# Altium schematic sheet 1_wiring drawing.SchDoc: CAN HUB
size A2; ApprovedBy: Approved By; CheckedBy: Sky; DrawnBy: Jack; Address1: 1; Address2: 2; Address3: 3; Address4: 4; DocumentNumber: 04-TE-42-4015-0PA-A; Revision: B; SheetNumber: 2; SheetTotal: 6; SheetSize: A2; CheckedByDate: 2022-11-19; DrawByDate: 2022-11-17; SiteName: EMS TD Huangpu; PageSetup: Record=PageOptions|CenterHorizontal=True|CenterVertical=True|PrintScale=0.73|XCorrection=1.00|YCorrection=1.00|PrintKind=0|BorderSize=5000000|LeftOffset=0|BottomOffset=0|Orientation=2|PaperLength=1000|PaperWidth=1000|Scale=100|PaperSource=15|PrintQuality=1200|MediaType=1|DitherType=10|PaperKind=A3|PrintScaleMode=1; ProjectName: 19205_BMW CCU DDR PCBA FT fixture wiring
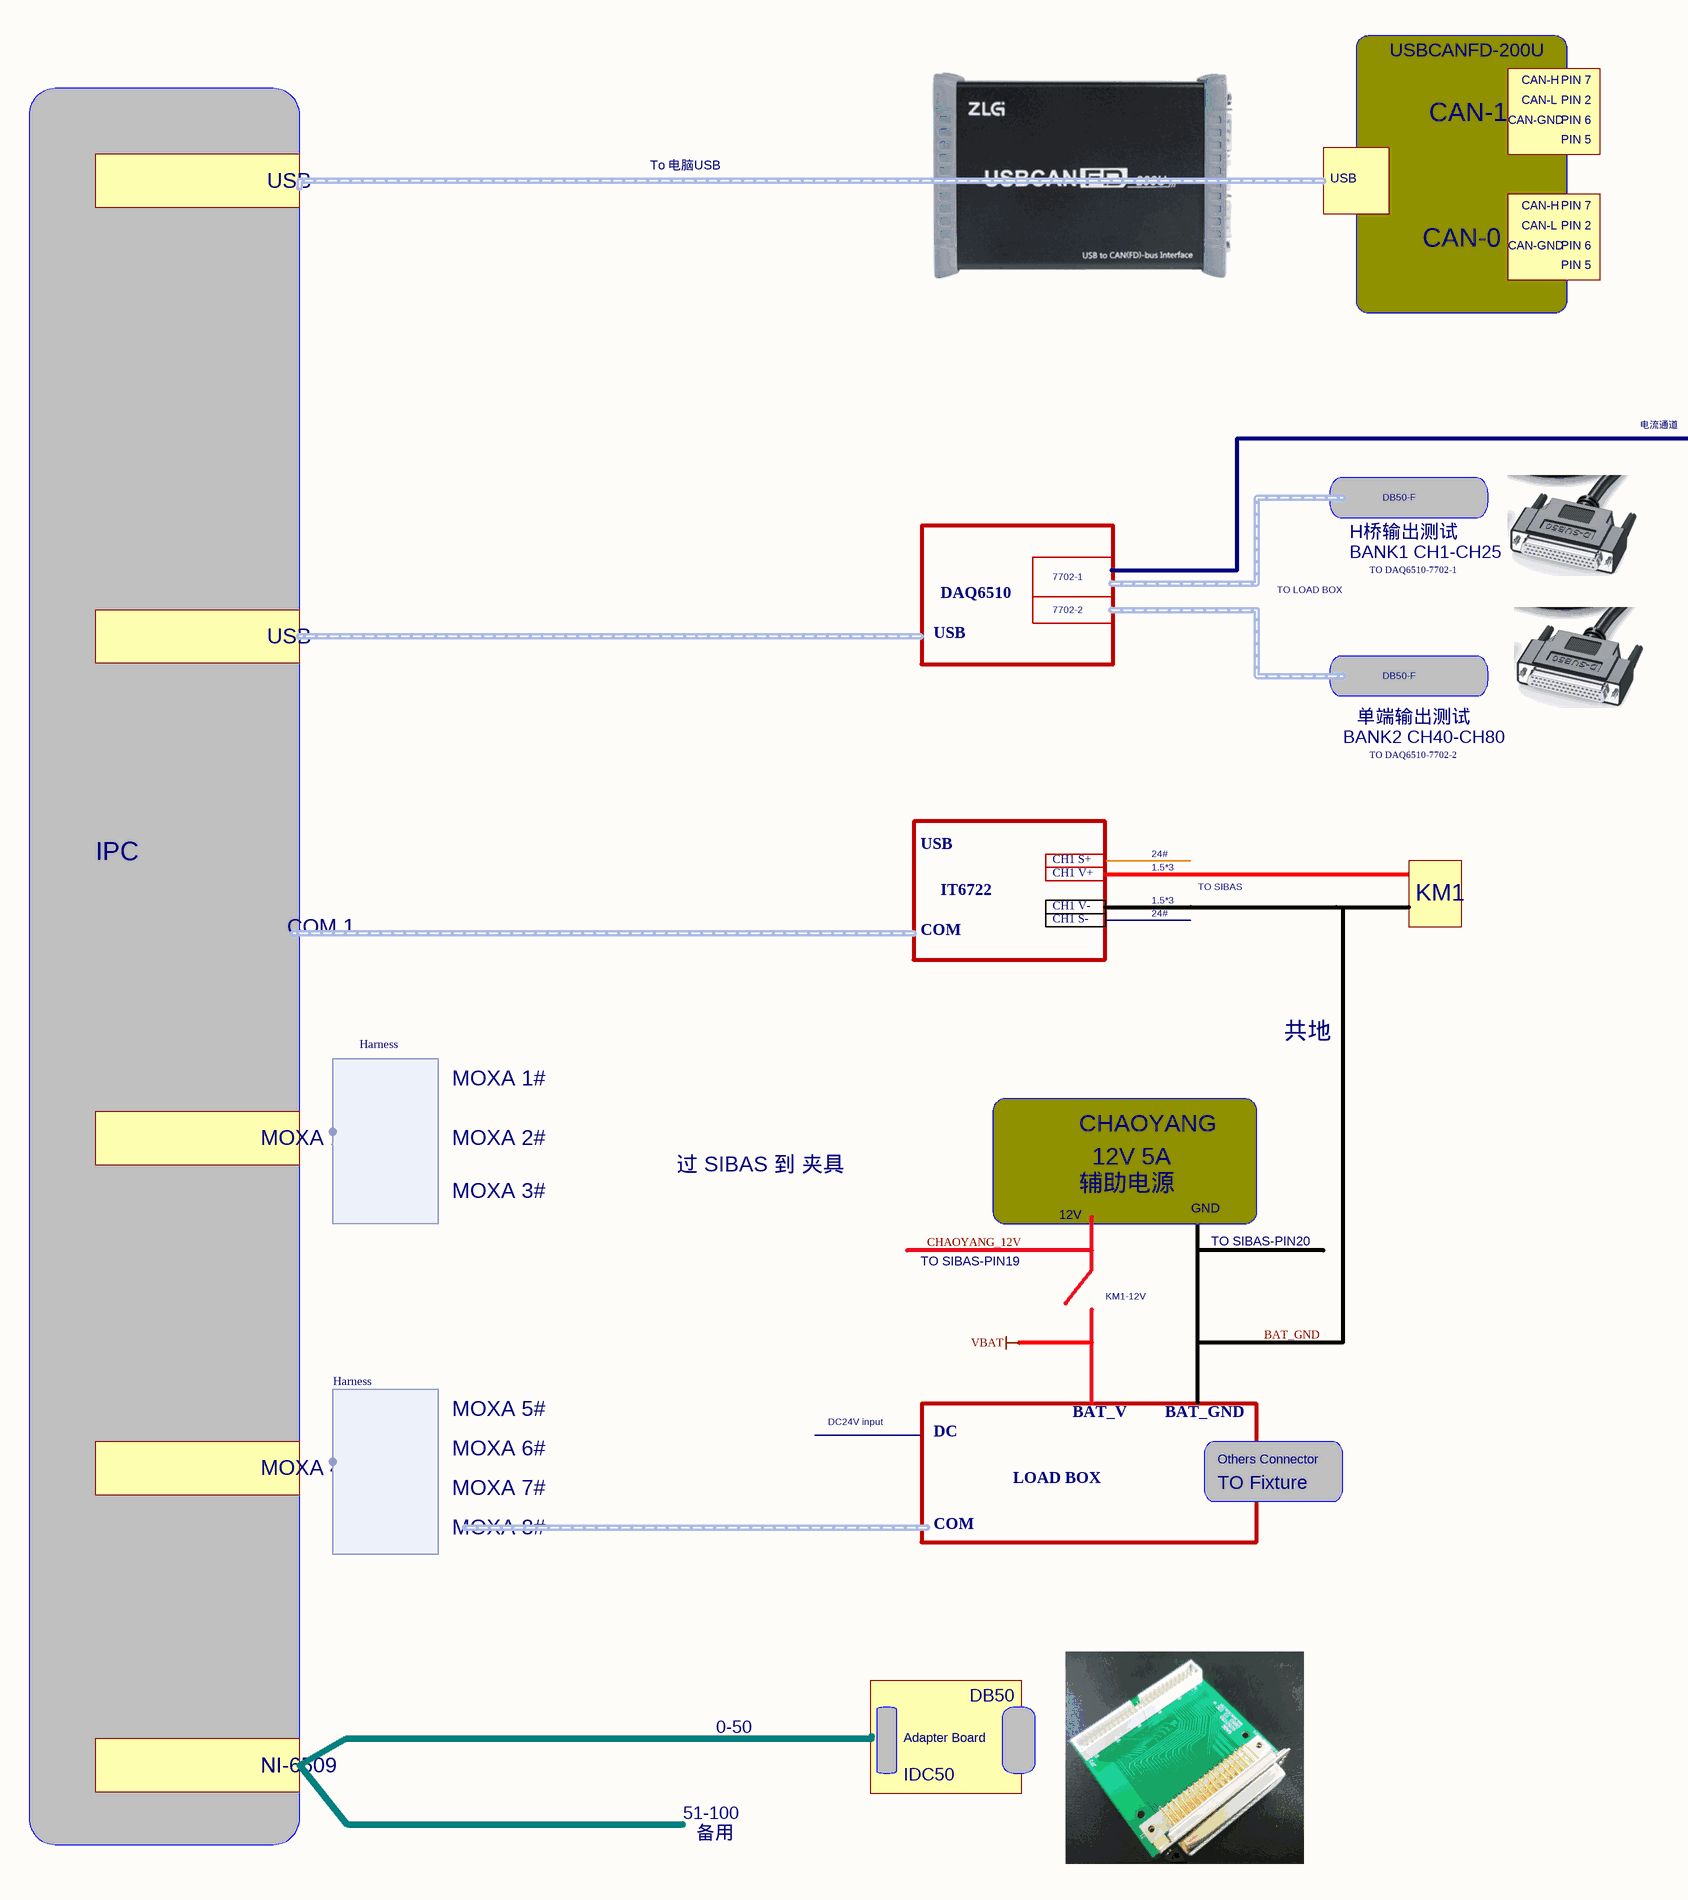
[diagram p0: 1_wiring drawing.SchDoc, left]
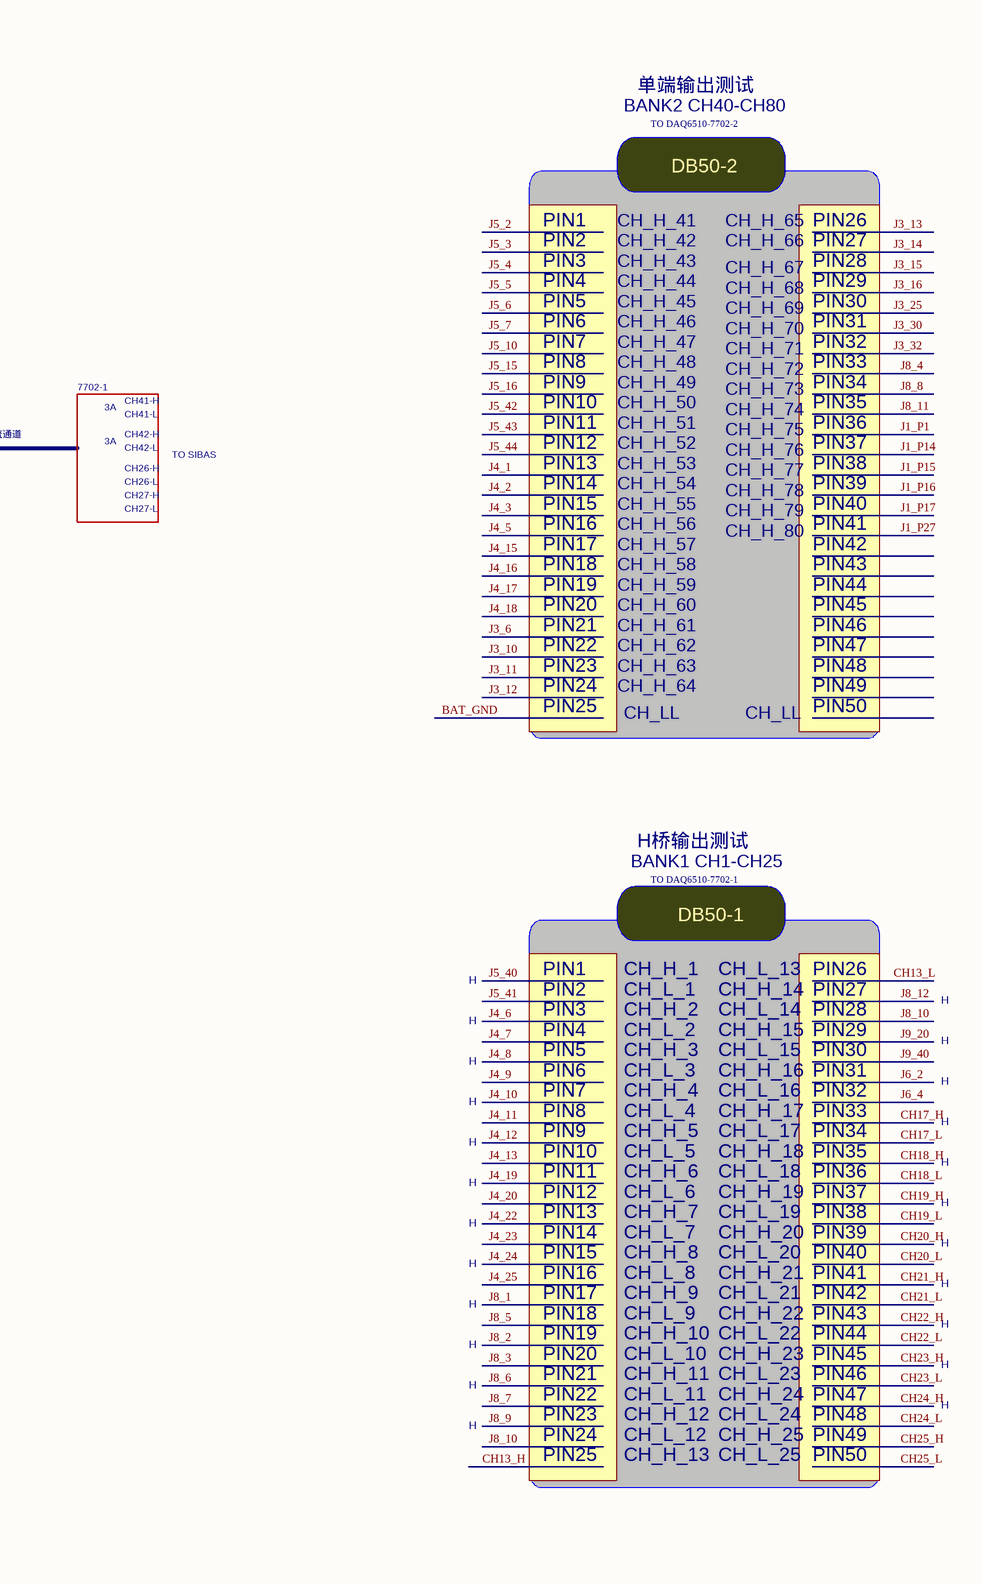
[diagram p1: 1_wiring drawing.SchDoc, right]

## Harnesses
Harness: 

## Notes on the sheet
- USBCANFD-200U
- CAN-H
- CAN-L
- PIN 2
- PIN 7
- BANK2 CH40-CH80
- 单端输出测试
- To 电脑USB
- USB
- CAN-1
- CAN-GND
- PIN 6
- PIN 5
- TO DAQ6510-7702-2
- DB50-2
- PIN1
- PIN2
- CH_H_41
- CH_H_42
- CH_H_65
- CH_H_66
- PIN26
- PIN27
- CAN-0
- PIN3
- PIN4
- PIN5
- CH_H_43
- CH_H_44
- CH_H_45
- CH_H_67
- CH_H_68
- CH_H_69
- PIN28
- PIN29
- PIN30
- PIN6
- PIN7
- PIN8
- CH_H_46
- CH_H_47
- CH_H_48
- CH_H_70
- CH_H_71
- CH_H_72
- PIN31
- PIN32
- PIN33
- 电流通道
- 7702-1
- 3A
- CH41-H
- CH41-L
- CH42-L
- CH42-H
- TO SIBAS
- PIN9
- PIN10
- PIN11
- PIN12
- CH_H_49
- CH_H_50
- CH_H_51
- CH_H_52
- CH_H_73
- CH_H_74
- CH_H_75
- CH_H_76
- PIN34
- PIN35
- PIN36
- PIN37
- DB50-F
- CH26-H
- CH26-L
- CH27-H
- CH27-L
- PIN13
- PIN14
- PIN15
- CH_H_53
- CH_H_54
- CH_H_55
- CH_H_77
- CH_H_78
- CH_H_79
- PIN38
- PIN39
- PIN40
- H桥输出测试
- BANK1 CH1-CH25
- TO DAQ6510-7702-1
- PIN16
- PIN17
- PIN18
- PIN19
- CH_H_56
- CH_H_57
- CH_H_58
- CH_H_59
- CH_H_80
- PIN41
- PIN42
- PIN43
- PIN44
- DAQ6510
- 7702-2
- TO LOAD BOX
- PIN20
- PIN21
- PIN22
- CH_H_60
- CH_H_61
- CH_H_62
- PIN45
- PIN46
- PIN47
- PIN23
- PIN24
- PIN25
- CH_H_63
- CH_H_64
- CH_LL
- PIN48
- PIN49
- PIN50
- IPC
- IT6722
- 1.5*3
- 24#
- KM1
- DB50-1
- COM 1
- COM
- H
- CH_H_1
- CH_L_1
- CH_H_14
- CH_L_13
- CH_H_2
- CH_H_3
- CH_L_2
- CH_H_15
- CH_L_14
- CH_L_15
- MOXA 1#
- 共地
- CH_H_4
- CH_L_3
- CH_L_4
- CH_H_16
- CH_H_17
- CH_L_16
- MOXA 1-3
- MOXA 2#
- CHAOYANG
- 12V 5A
- CH_H_5
- CH_H_6
- CH_L_5
- CH_H_18
- CH_L_18
- CH_L_17
- MOXA 3#
- 过 SIBAS 到 夹具
- 12V
- 辅助电源
- GND
- CH_H_7
- CH_H_8
- CH_L_6
- CH_L_7
- CH_H_19
- CH_H_20
- CH_L_19
- CH_L_20
- TO SIBAS-PIN19
- KM1-12V
- TO SIBAS-PIN20
- CH_H_9
- CH_L_8
- CH_L_9
- CH_H_21
- CH_H_22
- CH_L_21
- CH_H_10
- CH_H_11
- CH_L_10
- CH_L_11
- CH_H_23
- CH_H_24
- CH_L_22
- CH_L_23
- MOXA 5#
- DC24V input
- BAT_V
- BAT_GND
- CH_H_12
- CH_H_13
- CH_L_12
- CH_H_25
- CH_L_24
- CH_L_25
- MOXA 4-8
- MOXA 6#
- MOXA 7#
- DC
- LOAD BOX
- TO Fixture
- Others Connector
- MOXA 8#
- 0-50
- Adapter Board
- DB50
- NI-6509
- 51-100
- IDC50
- 备用
- Labels drawn without touching a wire or pin: BAT_GND, CH1 S+, CH1 S-, CH1 V+, CH1 V-, CHAOYANG_12V
- Document Number:
- Rev:
- Project Name:
- Drawn By:
- Date:
- Titile:
- Checked By:
- Sheet:
- Of